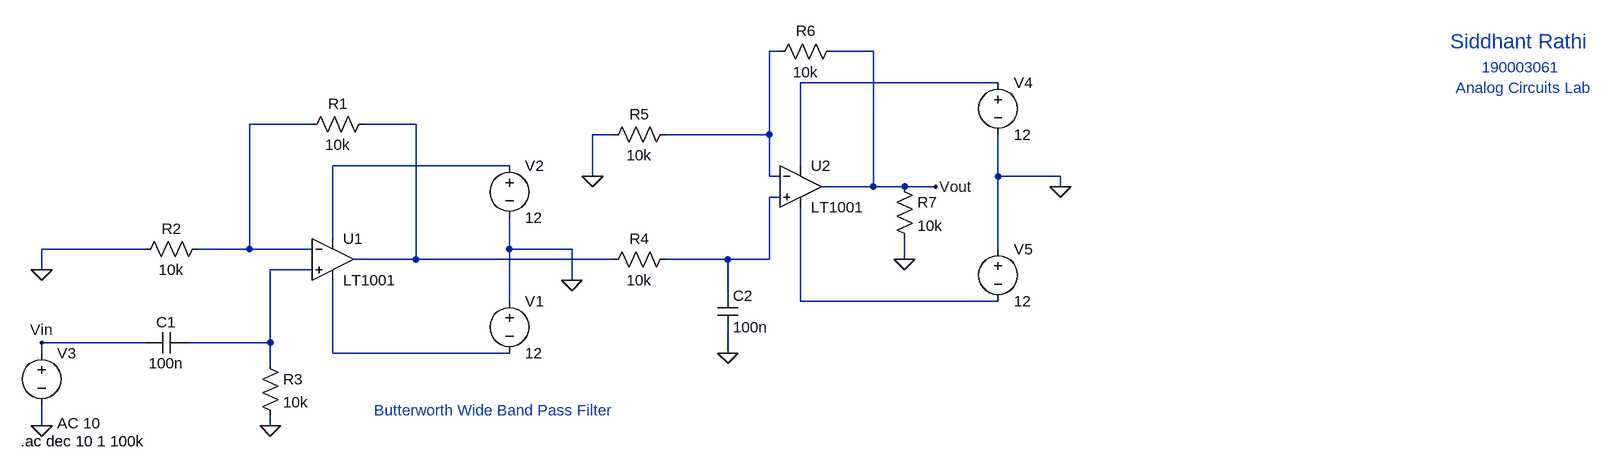
[diagram p0: schematic Butterworth BPF.asc]
Butterworth BPF.asc, the LTspice schematic file:
Version 4
SHEET 1 1780 680
WIRE 512 -48 496 -48
WIRE 656 -48 592 -48
WIRE 848 0 544 0
WIRE -208 64 -304 64
WIRE -48 64 -128 64
WIRE 256 80 224 80
WIRE 496 80 496 -48
WIRE 496 80 336 80
WIRE 96 128 -176 128
WIRE 544 128 544 0
WIRE 224 144 224 80
WIRE 496 144 496 80
WIRE 512 144 496 144
WIRE 848 144 848 80
WIRE 944 144 848 144
WIRE 656 160 656 -48
WIRE 656 160 576 160
WIRE 704 160 656 160
WIRE 752 160 704 160
WIRE 944 160 944 144
WIRE 512 176 496 176
WIRE -176 240 -176 128
WIRE -464 256 -624 256
WIRE -304 256 -304 64
WIRE -304 256 -384 256
WIRE -208 256 -304 256
WIRE 96 256 96 208
WIRE 192 256 96 256
WIRE 848 256 848 144
WIRE -48 272 -48 64
WIRE -48 272 -144 272
WIRE 256 272 -48 272
WIRE 432 272 336 272
WIRE 496 272 496 176
WIRE 496 272 432 272
WIRE 704 272 704 240
WIRE -624 288 -624 256
WIRE -208 288 -272 288
WIRE 192 304 192 256
WIRE 432 320 432 272
WIRE 96 336 96 256
WIRE 544 336 544 192
WIRE 848 336 544 336
WIRE -464 400 -624 400
WIRE -272 400 -272 288
WIRE -272 400 -400 400
WIRE -624 416 -624 400
WIRE -176 416 -176 304
WIRE 96 416 -176 416
WIRE 432 416 432 384
WIRE -272 432 -272 400
WIRE -624 528 -624 496
WIRE -272 528 -272 512
FLAG -624 288 0
FLAG -624 528 0
FLAG -272 528 0
FLAG -624 400 Vin
FLAG 944 160 0
FLAG 224 144 0
FLAG 752 160 Vout
FLAG 432 416 0
FLAG 704 272 0
FLAG 192 304 0
SYMBOL OpAmps\\LT1001 -176 208 R0
SYMATTR InstName U1
SYMBOL res -112 48 R90
WINDOW 0 0 56 VBottom 2
WINDOW 3 32 56 VTop 2
SYMATTR InstName R1
SYMATTR Value 10k
SYMBOL res -368 240 R90
WINDOW 0 0 56 VBottom 2
WINDOW 3 32 56 VTop 2
SYMATTR InstName R2
SYMATTR Value 10k
SYMBOL voltage 96 320 R0
WINDOW 123 0 0 Left 0
WINDOW 39 0 0 Left 0
SYMATTR InstName V1
SYMATTR Value 12
SYMBOL voltage 96 112 R0
WINDOW 123 0 0 Left 0
WINDOW 39 0 0 Left 0
SYMATTR InstName V2
SYMATTR Value 12
SYMBOL voltage -624 400 R0
WINDOW 123 24 124 Left 2
WINDOW 39 0 0 Left 0
SYMATTR Value2 AC 10
SYMATTR InstName V3
SYMATTR Value ""
SYMBOL cap -400 384 R90
WINDOW 0 0 32 VBottom 2
WINDOW 3 32 32 VTop 2
SYMATTR InstName C1
SYMATTR Value 100n
SYMBOL res -288 416 R0
SYMATTR InstName R3
SYMATTR Value 10k
SYMBOL res 352 256 R90
WINDOW 0 0 56 VBottom 2
WINDOW 3 32 56 VTop 2
SYMATTR InstName R4
SYMATTR Value 10k
SYMBOL res 352 64 R90
WINDOW 0 0 56 VBottom 2
WINDOW 3 32 56 VTop 2
SYMATTR InstName R5
SYMATTR Value 10k
SYMBOL res 608 -64 R90
WINDOW 0 0 56 VBottom 2
WINDOW 3 32 56 VTop 2
SYMATTR InstName R6
SYMATTR Value 10k
SYMBOL OpAmps\\LT1001 544 96 R0
SYMATTR InstName U2
SYMBOL voltage 848 -16 R0
WINDOW 123 0 0 Left 0
WINDOW 39 0 0 Left 0
SYMATTR InstName V4
SYMATTR Value 12
SYMBOL voltage 848 240 R0
WINDOW 123 0 0 Left 0
WINDOW 39 0 0 Left 0
SYMATTR InstName V5
SYMATTR Value 12
SYMBOL cap 416 320 R0
SYMATTR InstName C2
SYMATTR Value 100n
SYMBOL res 688 144 R0
SYMATTR InstName R7
SYMATTR Value 10k
TEXT -112 504 Left 2 ;Butterworth Wide Band Pass Filter
TEXT -656 552 Left 2 !.ac dec 10 1 100k
TEXT 1544 -64 Left 3 ;Siddhant Rathi
TEXT 1592 -24 Left 2 ;190003061
TEXT 1552 8 Left 2 ;Analog Circuits Lab

The netlist it stands for:
* Butterworth BPF.asc
XU1 N007 N003 N005 N009 N004 LT1001  ; pins In+ In- V+ V- OUT
R1 N004 N003 10k
R2 N003 0 10k
V1 0 N009 12
V2 N005 0 12
V3 Vin 0 AC 10
C1 N007 Vin 100n
R3 N007 0 10k
R4 N006 N004 10k
R5 N001 0 10k
R6 Vout N001 10k
XU2 N006 N001 N002 N008 Vout LT1001  ; pins In+ In- V+ V- OUT
V4 N002 0 12
V5 0 N008 12
C2 N006 0 100n
R7 Vout 0 10k
* Butterworth Wide Band Pass Filter
.ac dec 10 1 100k
* Siddhant Rathi
* 190003061
* Analog Circuits Lab
.lib LTC.lib
.backanno
.end